# Altium schematic sheet CANConnector.SchDoc
size A; SheetNumber: 2; SheetTotal: 15
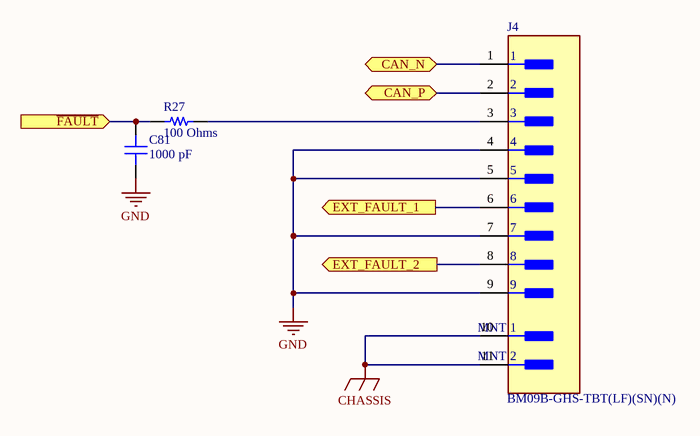
[diagram p0: CANConnector.SchDoc]

## Parts
C81  1000 pF  [CAP 0402_1005]
J4  BM09B-GHS-TBT(LF)(SN)(N)  [FP-BM09B-GHS-TBT_LF_SN-MFG]
R27  100 Ohms  [RES 0402_1005]

## Ports
CAN_N (bidir), CAN_P (bidir), EXT_FAULT_1 (out), EXT_FAULT_2 (out), ~{FAULT} (in)

## Nets
CHASSIS: J4.10(MNT_1) J4.11(MNT_2)
GND: C81.1 J4.4 J4.5 J4.7 J4.9
CAN_N: J4.1 ; port CAN_N
CAN_P: J4.2 ; port CAN_P
EXT_FAULT_1: J4.6 ; port EXT_FAULT_1
EXT_FAULT_2: J4.8 ; port EXT_FAULT_2
~{FAULT}: C81.2 R27.1 ; port ~{FAULT}
NetJ4_3: J4.3 R27.2

## Library data of the parts
C81 = UMK105CG102JVHF: CAP CER 1000PF 50V C0G/NP0 0402; manufacturer: Taiyo Yuden; Temperature Coefficient: C0G, NP0; Tolerance: ±5%; Part Number: UMK105CG102JVHF; Capacitance: 1000 pF; Applications: Automotive; componentlink1description: Datasheet; componentlink1url: https://ds.yuden.co.jp/TYCOMPAS/ut/detail?pn=UMK105CG102JVHF &u=M; componentlink2description: DigiKey Link; componentlink2url: https://www.digikey.com/en/products/detail/taiyo-yuden/UMK105CG102JVHF/4811103; Device Package: 0402 (1005 Metric); lastupdated: 2/9/2024 8:04:38 PM; Lifecycle Status: Active; Minimum Order: 1; Mounting Type: Surface Mount, MLCC; Operating Temperature: -55°C ~ 125°C; Package / Case: 0402 (1005 Metric); packaging: TapeAndReel; partid: 1779; Part Status: Active; price: 0.01; Ratings: AEC-Q200; series: M; Size / Dimension: 0.039" L x 0.020" W (1.00mm x 0.50mm); Supplier 1: DigiKey; Supplier Part Number 1: 587-3737-1-ND; Thickness (Max): 0.022" (0.55mm); value: 1000 pF; Voltage - Rated: 50V
J4 = CMP-17439-000449-1: CONN HEADER SMD 9POS 1.25MM
R27 = WR04X1000FTL: RES 100 OHM 1% 1/16W 0402; Manufacturer: Walsin Technology Corporation; Power (Watts): 0.063W, 1/16W; Temperature Coefficient: ±100ppm/°C; Part Number: WR04X1000FTL; Value: 100 Ohms; ComponentLink1Description: Datasheet; ComponentLink1URL: https://www.passivecomponent.com/wp-content/uploads/chipR/ASC_WR.pdf; ComponentLink2Description: DigiKey Link; ComponentLink2URL: https://www.digikey.com/en/products/detail/walsin-technology-corporation/WR04X1000FTL/13241075; Composition: Thick Film; Device Package: 0402 (1005 Metric); Height - Seated (Max): 0.016" (0.40mm); LastUpdated: 2/9/2024 8:28:55 PM; Lifecycle Status: Active; Minimum Order: 1; Number of Terminations: 2; Operating Temperature: -55°C ~ 155°C; Package / Case: 0402 (1005 Metric); Packaging: CutTape; PartId: 64787; Part Status: Active; Price: 0.01; Resistance: 100 Ohms; Series: WR; Size / Dimension: 0.039" L x 0.020" W (1.00mm x 0.50mm); Supplier 1: DigiKey; Supplier Part Number 1: 1292-WR04X1000FTLCT-ND; Supplier Device Package: 0402; Tolerance: ±1%